# Altium project v4_project.PrjPCB
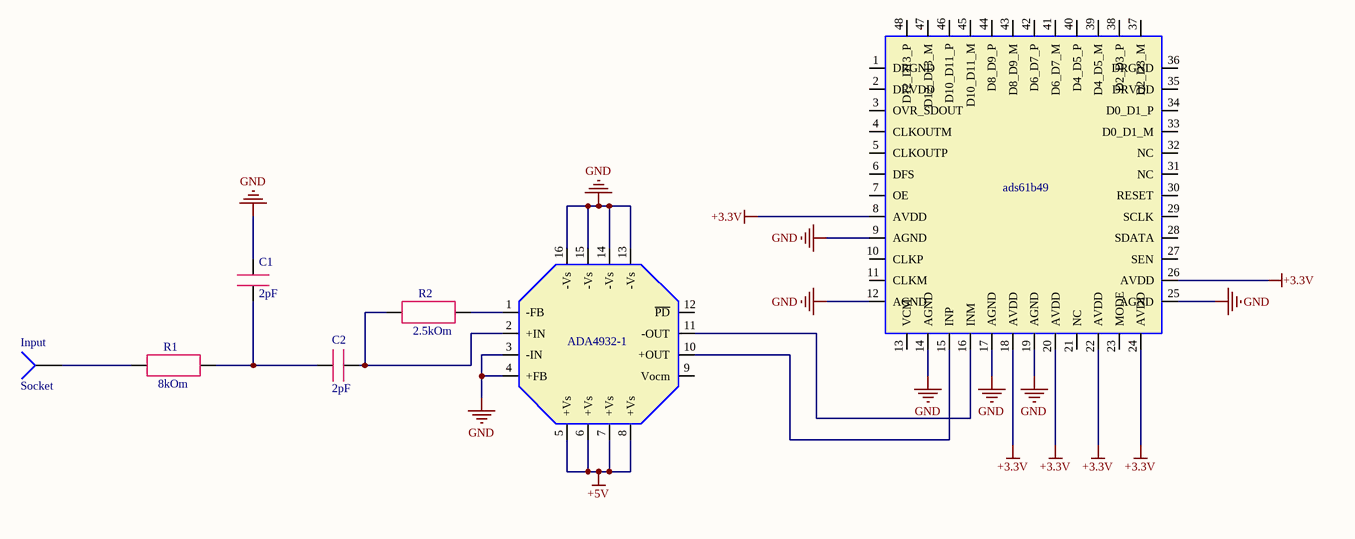
[diagram p0: v4_Schematic.SchDoc]
1 sheet, 7 parts. Net scope: global (net labels, ports and power ports of the same name join across sheets).
Board file: v4_Ñircuit_board.PcbDoc

## Sheet v4_Schematic.SchDoc
size A4

### Parts
ADA4932-1  ADA4932-1  [ADA4932-1]
ads61b49  ads61b49  [ADS1b49]
C1  2pF  [C_Capicator]
C2  2pF  [C_Capicator]
Input  Socket  [PIN1]
R1  8kOm  [R_Resistor]
R2  2.5kOm  [R_Resistor]

### Nets
+3.3V: ads61b49.8(AVDD) ads61b49.18(AVDD) ads61b49.20(AVDD) ads61b49.22(AVDD) ads61b49.24(AVDD) ads61b49.26(AVDD)
+5V: ADA4932-1.5(+Vs) ADA4932-1.6(+Vs) ADA4932-1.7(+Vs) ADA4932-1.8(+Vs)
GND: ADA4932-1.3(-IN) ADA4932-1.4(+FB) ADA4932-1.13(-Vs) ADA4932-1.14(-Vs) ADA4932-1.15(-Vs) ADA4932-1.16(-Vs) ads61b49.9(AGND) ads61b49.12(AGND) ads61b49.14(AGND) ads61b49.17(AGND) ads61b49.19(AGND) ads61b49.25(AGND) C1.2
NetADA4932-1_1: ADA4932-1.1(-FB) R2.2
NetADA4932-1_2: ADA4932-1.2(+IN) C2.2 R2.1
NetADA4932-1_10: ADA4932-1.10(+OUT) ads61b49.15(INP)
NetADA4932-1_11: ADA4932-1.11(-OUT) ads61b49.16(INM)
NetC1_1: C1.1 C2.1 R1.2
NetInput_1: Input.1 R1.1

Not connected (* = marked no-connect by the designer): ADA4932-1 9(Vocm) 12(~{PD}); ads61b49 1(DRGND) 2(DRVDD) 3(OVR_SDOUT) 4(CLKOUTM) 5(CLKOUTP) 6(DFS) 7(OE) 10(CLKP) 11(CLKM) 13(VCM) 21(NC) 23(MODE) 27(SEN) 28(SDATA) 29(SCLK) 30(RESET) 31(NC) 32(NC) 33(D0_D1_M) 34(D0_D1_P) 35(DRVDD) 36(DRGND) 37(D2_D3_M) 38(D2_D3_P) 39(D4_D5_M) 40(D4_D5_P) 41(D6_D7_M) 42(D6_D7_P) 43(D8_D9_M) 44(D8_D9_P) 45(D10_D11_M) 46(D10_D11_P) 47(D12_D13_M) 48(D12_D13_P)

### Library data of the parts
C1 C2 = Ñapacitor
R1 = Resistance: 8 kOm
R2 = Resistance
Input = Socket: LatestRevisionDate: 17-Jul-2002; LatestRevisionNote: Re-released for DXP Platform.; Publisher: Altium Limited